# Altium schematic sheet Sheet1.SchDoc
size B; SheetNumber: 1; SheetTotal: 1; SPICEModelCacheMPXNSZBY: <root> / <DocumentId>MPXNSZBY</DocumentId> / </root>
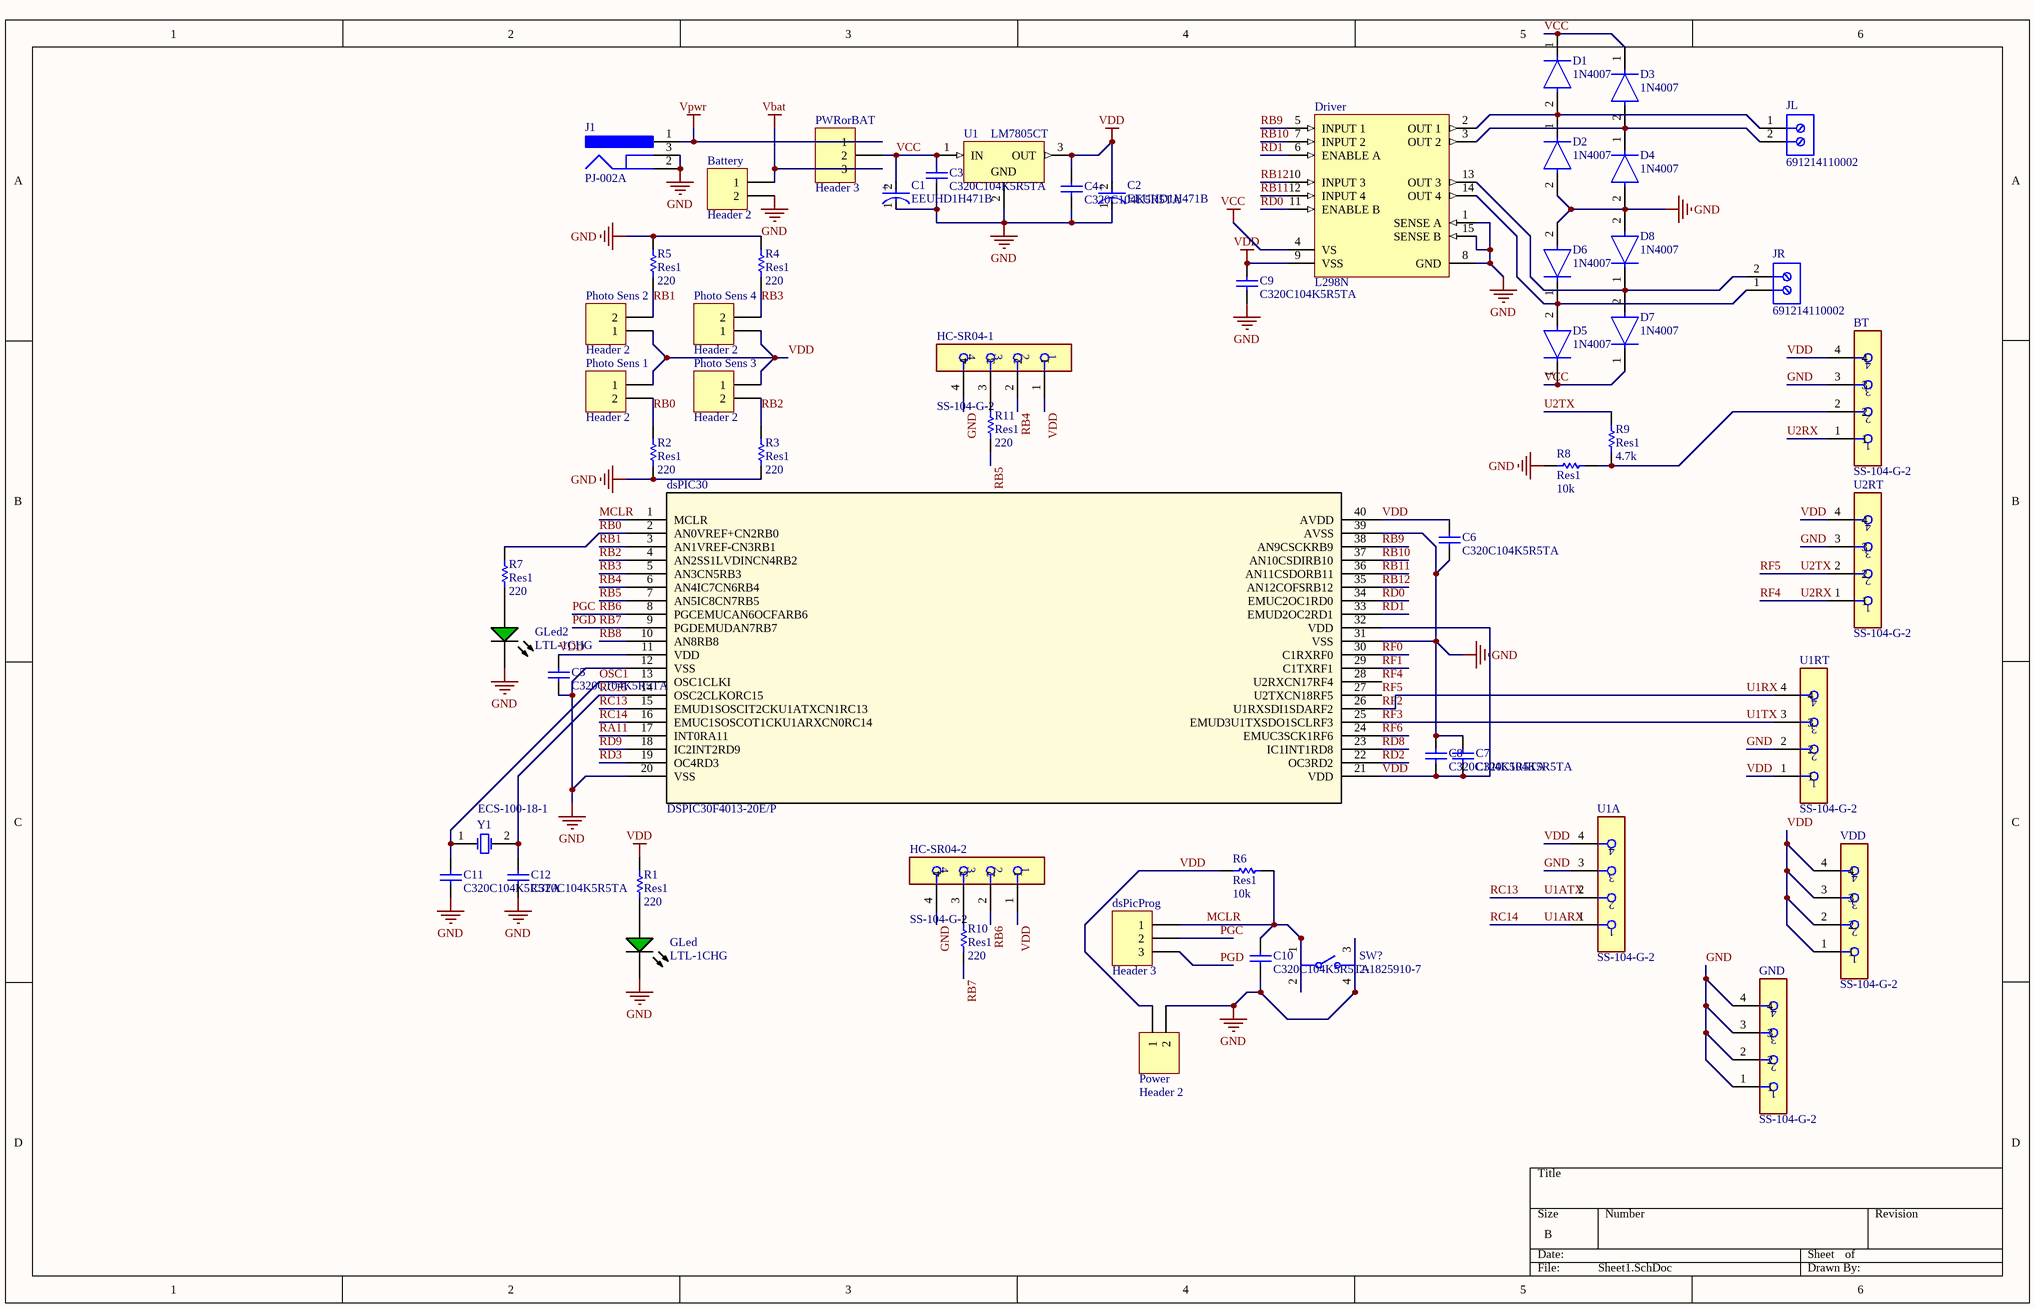
[diagram p0: Sheet1.SchDoc]

## Parts
Battery  Header 2  [HDR1X2]
BT  SS-104-G-2  [FP-SS-104-G-2-MFG]
C1  EEUHD1H471B  [FP-RAD-TH-D_10_0_5-L_20_2-MFG]
C2  EEUHD1H471B  [FP-RAD-TH-D_10_0_5-L_20_2-MFG]
C3  C320C104K5R5TA  [CAPR51-254-508X318X736]
C4  C320C104K5R5TA  [CAPR51-254-508X318X736]
C5  C320C104K5R5TA  [CAPR51-254-508X318X736]
C6  C320C104K5R5TA  [CAPR51-254-508X318X736]
C7  C320C104K5R5TA  [CAPR51-254-508X318X736]
C8  C320C104K5R5TA  [CAPR51-254-508X318X736]
C9  C320C104K5R5TA  [CAPR51-254-508X318X736]
C10  C320C104K5R5TA  [CAPR51-254-508X318X736]
C11  C320C104K5R5TA  [CAPR51-254-508X318X736]
C12  C320C104K5R5TA  [CAPR51-254-508X318X736]
D1  1N4007  [FP-1N4007-MFG]
D2  1N4007  [FP-1N4007-MFG]
D3  1N4007  [FP-1N4007-MFG]
D4  1N4007  [FP-1N4007-MFG]
D5  1N4007  [FP-1N4007-MFG]
D6  1N4007  [FP-1N4007-MFG]
D7  1N4007  [FP-1N4007-MFG]
D8  1N4007  [FP-1N4007-MFG]
Driver  L298N  [STM-FM-15]
dsPIC30  DSPIC30F4013-20E/P  [PDIP600-P40]
dsPicProg  Header 3  [HDR1X3]
GLed  LTL-1CHG  [LTST-LTL-1CHG-2]
GLed2  LTL-1CHG  [LTST-LTL-1CHG-2]
GND  SS-104-G-2  [FP-SS-104-G-2-MFG]
HC-SR04-1  SS-104-G-2  [FP-SS-104-G-2-MFG]
HC-SR04-2  SS-104-G-2  [FP-SS-104-G-2-MFG]
J1  PJ-002A  [CUI-PJ-002A_V]
JL  691214110002  [691214110002]
JR  691214110002  [691214110002]
Photo_Sens_1  Header 2  [HDR1X2]
Photo_Sens_2  Header 2  [HDR1X2]
Photo_Sens_3  Header 2  [HDR1X2]
Photo_Sens_4  Header 2  [HDR1X2]
Power  Header 2  [HDR1X2]
PWRorBAT  Header 3  [HDR1X3]
R1  Res1  value 220  [AXIAL-0.3]
R2  Res1  value 220  [AXIAL-0.3]
R3  Res1  value 220  [AXIAL-0.3]
R4  Res1  value 220  [AXIAL-0.3]
R5  Res1  value 220  [AXIAL-0.3]
R6  Res1  value 10k  [AXIAL-0.3]
R7  Res1  value 220  [AXIAL-0.3]
R8  Res1  value 10k  [AXIAL-0.3]
R9  Res1  value 4.7k  [AXIAL-0.3]
R10  Res1  value 220  [AXIAL-0.3]
R11  Res1  value 220  [AXIAL-0.3]
SW?  2-1825910-7  [FP-2-1825910-7-MFG]
U1  LM7805CT  [FAIR-TO-220-3]
U1A  SS-104-G-2  [FP-SS-104-G-2-MFG]
U1RT  SS-104-G-2  [FP-SS-104-G-2-MFG]
U2RT  SS-104-G-2  [FP-SS-104-G-2-MFG]
VDD  SS-104-G-2  [FP-SS-104-G-2-MFG]
Y1  ECS-100-18-1  [HC-49U]

## Nets
GND: Battery.2 BT.3 C1.1(C) C2.1(C) C3.1 C4.1 C5.1 C6.1 C7.2 C8.2 C9.1 C10.1 C11.1 C12.1 D2.2(A) D4.2(A) D6.2(A) D8.2(A) Driver.1(SENSE_A) Driver.8(GND) Driver.15(SENSE_B) dsPIC30.12(VSS) dsPIC30.20(VSS) dsPIC30.31(VSS) dsPIC30.39(AVSS) GLed.2(K) GLed2.2(K) GND.1 GND.2 GND.3 GND.4 HC-SR04-1.4 HC-SR04-2.4 J1.2 J1.3 Power.2 R2.1 R3.1 R4.2 R5.2 R8.2 SW?.3 SW?.4 U1.2(GND) U1A.3 U1RT.2 U2RT.3
Vbat: Battery.1 PWRorBAT.3
VCC: C1.2(A) C3.2 D1.1(C) D3.1(C) D5.1(C) D7.1(C) Driver.4(VS) PWRorBAT.2 U1.1(IN)
VDD: BT.4 C2.2(A) C4.2 C5.2 C6.2 C7.1 C8.1 C9.2 Driver.9(VSS) dsPIC30.11(VDD) dsPIC30.21(VDD) dsPIC30.32(VDD) dsPIC30.40(AVDD) HC-SR04-1.1 HC-SR04-2.1 Photo_Sens_1.1 Photo_Sens_2.1 Photo_Sens_3.1 Photo_Sens_4.1 Power.1 R1.2 R6.2 U1.3(OUT) U1A.4 U1RT.1 U2RT.4 VDD.1 VDD.2 VDD.3 VDD.4
Vpwr: J1.1 PWRorBAT.1
MCLR: C10.2 dsPIC30.1(MCLR) dsPicProg.1 R6.1 SW?.1 SW?.2
OSC1: C11.2 dsPIC30.13(OSC1CLKI) Y1.1(OSC1)
PGC: dsPIC30.8(PGCEMUCAN6OCFARB6) dsPicProg.2 HC-SR04-2.2  [also labelled RB6]
PGD: dsPIC30.9(PGDEMUDAN7RB7) dsPicProg.3 R10.1  [also labelled RB7]
RA11: dsPIC30.17(INT0RA11)
RB0: dsPIC30.2(AN0VREF+CN2RB0) Photo_Sens_1.2 R2.2 R7.2
RB1: dsPIC30.3(AN1VREF-CN3RB1) Photo_Sens_2.2 R5.1
RB2: dsPIC30.4(AN2SS1LVDINCN4RB2) Photo_Sens_3.2 R3.2
RB3: dsPIC30.5(AN3CN5RB3) Photo_Sens_4.2 R4.1
RB4: dsPIC30.6(AN4IC7CN6RB4) HC-SR04-1.2
RB5: dsPIC30.7(AN5IC8CN7RB5) R11.1
RB8: dsPIC30.10(AN8RB8)
RB9: Driver.5(INPUT_1) dsPIC30.38(AN9CSCKRB9)
RB10: Driver.7(INPUT_2) dsPIC30.37(AN10CSDIRB10)
RB11: Driver.12(INPUT_4) dsPIC30.36(AN11CSDORB11)
RB12: Driver.10(INPUT_3) dsPIC30.35(AN12COFSRB12)
RC13: dsPIC30.15(EMUD1SOSCIT2CKU1ATXCN1RC13) U1A.2  [also labelled U1ATX]
RC14: dsPIC30.16(EMUC1SOSCOT1CKU1ARXCN0RC14) U1A.1  [also labelled U1ARX]
RC15: C12.2 dsPIC30.14(OSC2CLKORC15) Y1.2(OSC2)
RD0: Driver.11(ENABLE_B) dsPIC30.34(EMUC2OC1RD0)
RD1: Driver.6(ENABLE_A) dsPIC30.33(EMUD2OC2RD1)
RD2: dsPIC30.22(OC3RD2)
RD3: dsPIC30.19(OC4RD3)
RD8: dsPIC30.23(IC1INT1RD8)
RD9: dsPIC30.18(IC2INT2RD9)
RF0: dsPIC30.30(C1RXRF0)
RF1: dsPIC30.29(C1TXRF1)
RF2: dsPIC30.26(U1RXSDI1SDARF2) U1RT.4  [also labelled U1RX]
RF3: dsPIC30.25(EMUD3U1TXSDO1SCLRF3) U1RT.3  [also labelled U1TX]
RF4: BT.1 dsPIC30.28(U2RXCN17RF4) U2RT.1  [also labelled U2RX]
RF5: dsPIC30.27(U2TXCN18RF5) R9.2 U2RT.2  [also labelled U2TX]
RF6: dsPIC30.24(EMUC3SCK1RF6)
NetBT_2: BT.2 R8.1 R9.1
NetD1_2: D1.2(A) D2.1(C) Driver.2(OUT_1) JL.1
NetD3_2: D3.2(A) D4.1(C) Driver.3(OUT_2) JL.2
NetD5_2: D5.2(A) D6.1(C) Driver.14(OUT_4) JR.1
NetD7_2: D7.2(A) D8.1(C) Driver.13(OUT_3) JR.2
NetGLed2_1: GLed2.1(A) R7.1
NetGLed_1: GLed.1(A) R1.1
NetHC-SR04-1_3: HC-SR04-1.3 R11.2
NetHC-SR04-2_3: HC-SR04-2.3 R10.2

## Notes on the sheet
- (in symbol CMP-05427-002121-1) +

## Library data of the parts
Battery Photo_Sens_1-Photo_Sens_4 Power = Header 2: Header, 2-Pin; LatestRevisionDate: 17-Jul-2002; LatestRevisionNote: Re-released for DXP Platform.; Publisher: Altium Limited
BT GND HC-SR04-1 HC-SR04-2 U1A U1RT U2RT VDD = CMP-02766-001709-1: CONN RCPT 4POS 0.1 GOLD PCB; Contact Resistance: 10mR; Number of Positions: 4; Pitch: 2.54mm; Gender: Female; Connector Type: Receptacle; Max Current Rating: 1A; Color: Black; Contact Material: Copper; Min Operating Temperature: -55°C; Max Operating Temperature: 125°C; Radiation Hardening: No; Termination: Solder; Depth: 2.54mm; Contact Plating: Gold; Orientation: Straight; Housing Color: Black; Width: 2.54mm; RoHS Compliant: Yes; Lead Free: Lead Free; Mount: Through Hole; Series: SS; Length: 10.16mm; Packaging: Bulk; Package Quantity: 1; Housing Material: Polyester; Number of Contacts: 4; Number of Rows: 1
C1 C2 = CMP-05427-002121-1: Aluminum Electrolytic Capacitors (Radial Lead Type) AEC-Q200 Qualified 470uF ±20% 50V
C3-C12 = CMP-1664-00004-1: Radial Leaded Multilayer Ceramic Capacitor, 0.1 uF, +/- 10%, 50 V, -55 to 125 degC, 2-Pin THD, RoHS, Tape and Reel; Case\Package: SOT-23-5; Max Power Dissipation: 250 mW; Output Current: 150 mA; Dropout Voltage: 260 mV; Outputs: 1; Output Voltage: 5 V; Max Input Voltage: 8 V; Min Operating Temperature: -40 degC; Packaging: Tape and Reel; Height: 1.3 mm; Radiation Hardening: No; Pins: 5; ComponentLink1Description: Manufacturer URL; Mount: Surface Mount; RoHSCompliant: true; Max Operating Temperature: 85 degC; PackageReference: CAPR51-254-508X318X736; ComponentLink2URL: http://www.kemet.com/docfinder?Partnumber=C320C104K5R5TA; PackageDescription: 2-Pin Through Hole Device, Body 5.08 x 3.18 mm, Pitch 2.54 mm; ComponentLink1URL: http://www.kemet.com/; Width: 1.8 mm; Package Quantity: 3000; DatasheetVersion: Dec-15; Length: 3 mm; ComponentLink2Description: Datasheet
D1-D8 = CMP-123542-000001-1: Rectifier diode 1000 V 1 A DO-41, ,; Manufacturer: Diotec; Max Surge Forward Current: 27A; Forward Current: 1A; Max Junction Temp: +175°C; Reverse Voltage: 1000V; Value: 15pF; Peak Reverse Current: 5uA; Category: Diode; Temperature Range Low: -50°C; Automotive: No; Temperature: -50°C to +175°C; Lead Free: Yes; ComponentLink2Description: Datasheet; Max Repetitive Reverse Voltage: 1000V; ComponentLink2URL: https://datasheet.octopart.com/1N4007-Diotec-datasheet-62346875.pdf; Manufacturer Part Number: 1N4007; Device Class L3: Rectifier Diodes; Height: 2.8mm; Octopart: https://octopart.com/1n4007-diotec-4040411; Package: 1N4007; Temperature Range High: +175°C; Device Class L1: Discrete Semiconductors; Device Class L2: Diodes; RoHS: TRUE; Capacitance: 15pF; Ipc Land Pattern Name: DIOAD888W100L520D280
Driver = CMP-2000-06526-1: Dual Full-Bridge Driver, 4.8 to 46 V, -40 to 150 degC, 15-Pin FM (MW 15L), RoHS, Tube; Manufacturer: STMicroelectronics; PartNumber: L298; Output Current: 2A; Supply Voltage Max: 7V; Driver Case Style: Multiwatt; Supply Voltage Min: 4.5V; No. of Pins: 15Pins; SVHC: NoSVHC(17-Dec-2015); Output Voltage: 46V; No. of Outputs: 4Outputs; Motor Type: FullBridge; MSL: -; Package Description: 15-Pin Flange Mount, Body 5 x 19.6 mm, Pitch 1.27 mm; Datasheet Version: 01/2000; Package Reference: FM-15; Mounting Technology: ThroughHole; Packaging: Each; Automotive Qualification Standard: -; Product Range: -; Datasheet URL: https://datasheet.ciiva.com/15109/getdatasheetpartid-50682-15109332.pdf; Operating Temperature Max: 130°C; Operating Temperature Min: -25°C; Manufacturer URL: http://www.st.com/
dsPIC30 = DSPIC30F4013-20EP: No Description Available; Mfr_Name: Microchip; Copyright: Copyright (C) 2024 Ultra Librarian. All rights reserved.; Manufacturer_Part_Number: DSPIC30F4013-20E/P; RefDes: RefDes; Type: DEV
dsPicProg PWRorBAT = Header 3: Header, 3-Pin; LatestRevisionDate: 17-Jul-2002; LatestRevisionNote: Re-released for DXP Platform.; Publisher: Altium Limited
GLed GLed2 = CMP-1674-00014-1: LITE-ON Electronic, INC, 120 mA, 100 mW, 5 V, -55 to 100 degC, 2-Pin THD, RoHS, Bulk; Case\Package: QFN; Max Supply Voltage: 3.6 V; Interface: I2C; Min Supply Voltage: 2.5 V; ComponentLink1URL: http://www.us.liteon.com/; DatasheetVersion: Mar-00; Max Operating Temperature: 85 degC; ComponentLink2URL: http://datasheet.octopart.com/LTL-1CHG-Lite-On-datasheet-143841.pdf; Min Operating Temperature: -40 degC; PackageReference: LTL-1CHG; RoHSCompliant: true; Pins: 24; PackageDescription: 2-Pin Through Hole Device, Dia 3.8 mm; ComponentLink1Description: Manufacturer URL; Packaging: Cut Tape; ComponentLink2Description: Datasheet; Package Quantity: 5000; REACH SVHC: No SVHC
J1 = CMP-2000-06895-2: Through Hole Right Angle DC Power Jack, 2.5 A, 2 mm Center Pin, 3 Position, -25 to 85 degC, RoHS, Bulk; Manufacturer: CUIInc.; Brand: CUI; Inside Contact Diameter: 2mm; Voltage Rating: 24V; Outside Contact Diameter: 6.5mm; Current Rating: 2.5A; Insulation Resistance: 50MOhms; Contact Gender: Male; Connector Type: DCPowerJack; Datasheet Version: Rev. 1.03, 04/2016; Housing Material: PolybutyleneTerephthalate(PBT); Operating Temperature Range: -25Cto+85C; Termination Style: ThroughHole; Product Category: DCPowerConnectors; Mounting Technology: ThroughHole; Mounting Style: ThroughHole; Factory Pack Quantity: 500; Contact Plating: Nickel; Package Reference: PJ-002A; Mounting Angle: Right; Package Description: 3-Pin Through Hole Device, Body 14.4 x 9 mm, Height 11 mm; Flammability Rating: UL94V-0; Manufacturer URL: http://www.cui.com/; Product: Jacks; Contact Material: Copper; Datasheet URL: http://www.cui.com/product/resource/pj-002a.pdf; RoHS: True
JL JR = CMP-1502-02464-2: NexarPartId: 18818288; Plating: Brass, Steel; Current: 10A; Pitch: 3.5052mm; Number of Levels: 1; Number of Contacts: 2; Wire Gauge (Min): 16AWG; Voltage: 300V; Wire Gauge (Max): 24AWG; Stripping Length: -6mm; Number of Pins: 2; Number of Rows: 1; REACH SVHC: Unknown; RoHS: Compliant; Housing Material: Nylon; Termination: Screw; Mount: Through Hole; Contact Plating: Brass, Tin; Number of Positions Per Level: 2; Color: Blue, Green; Width: 7.9mm; Voltage Rating: 300V; Length: 7.4mm; Current Rating: 10A; Wire/Cable Gauge: 24AWG; Packaging: Box; Max Operating Temperature: 105°C; Lead Pitch: 3.5mm; Height: 8.7mm; Contact Material: Brass; Min Operating Temperature: -40°C
R1-R11 = Res1: Resistor; Published: 8-Jun-2000; LatestRevisionDate: 17-Jul-2002; LatestRevisionNote: Re-released for DXP Platform.; PackageReference: AXIAL-0.3; Publisher: Altium Limited; PackageDescription: Axial Device, Thru-Hole; 2 Leads; 0.3 in Pin Spacing
SW? = CMP-03402-000004-1: SWITCH TACTILE SPST-NO 0.05A 24V; Manufacturer: TE Connectivity; Contact Current Rating: 50mA; Operating Force: 160gf; Electromechanical Life: 100000Cycles; Contact Resistance: 100mΩ; ComponentLink2Description: Datasheet; Height: 13.3mm; Digikey Description: SWITCH TACTILE SPST-NO 0.05A 24V; Device Class L2: Switches; Category: Switch; Device Class L3: Pushbutton Switches; Manufacturer Part Number: 2-1825910-7; Device Class L1: Electromechanical; Mount: Through Hole; Temperature Range High: +85°C; ComponentLink2URL: https://www.te.com/commerce/DocumentDelivery/DDEController?Action=showdoc&DocId=Customer+Drawing%7F1825910%7FC10%7Fpdf%7FEnglish%7FENG_CD_1825910_C10.pdf%7F2-1825910-7; RoHS: TRUE; Temperature: -35°C to +85°C; Mouser Description: Switch Tactile OFF (ON) SPST Extended Round Button PC Pins 0.05A 24VDC 100000Cycles 1.57N Thru-Hole Loose; Automotive: No; Voltage Rating Dc: 24V; Package: 2-1825910-7; Lead Free: Yes; Octopart: https://octopart.com/2-1825910-7-te+connectivity-42270510; Temperature Range Low: -35°C; Throw Configuration: SPST-NO
U1 = CMP-2000-04938-1: Positive Voltage Regulator, 5 V, 1 A, -40 to 125 degC, 3-Pin TO-220, RoHS, Tube; Manufacturer: FairchildSemiconductor; Maximum Input Voltage: 35V; Maximum Quiescent Current: 8mA; Load Regulation: 100mV; Maximum Output Current: 2.2(Typ)A; Output Type: Fixed; Typical Dropout Voltage @ Current: 2@1AV; Rad Hard: No; Output Voltage: 5V; Accuracy: ±4%; Number of Outputs: 1; Category: LinearRegulator; Package Description: 3-Pin Through Hole Device, Body 10 x 4.5 mm, Pitch 2.54 mm; Packaging: Rail/Tube; Mounting: ThroughHole; Polarity: Positive; Manufacturer URL: https://www.fairchildsemi.com/; Line Regulation: 100mV; Datasheet Version: Aug-12; Datasheet URL: https://datasheet.ciiva.com/26904/lm7805ct-26904988.pdf; Package Reference: TO-220; Package URL: https://www.fairchildsemi.com/package-drawings/TO/TO220B03.pdf; Package: 3TO-220AB; Operating Temperature: -40to125degC; Type: Linear
Y1 = ECS-10-13-1: Crystal Oscillator; Published: 17-Jul-2002; DatasheetDocument: 18-Apr-2000; PackageReference: HC-49U; Publisher: Altium Limited; ComponentLink1Description: Manufacturer Link; ComponentLink1URL: http://www.ecsxtal.com/; ComponentLink2Description: Datasheet; ComponentLink2URL: http://www.ecsxtal.com/pdf2/HC49U.PDF